# EAGLE design base_plate_noisy_crickets (EAGLE 9.6.2)
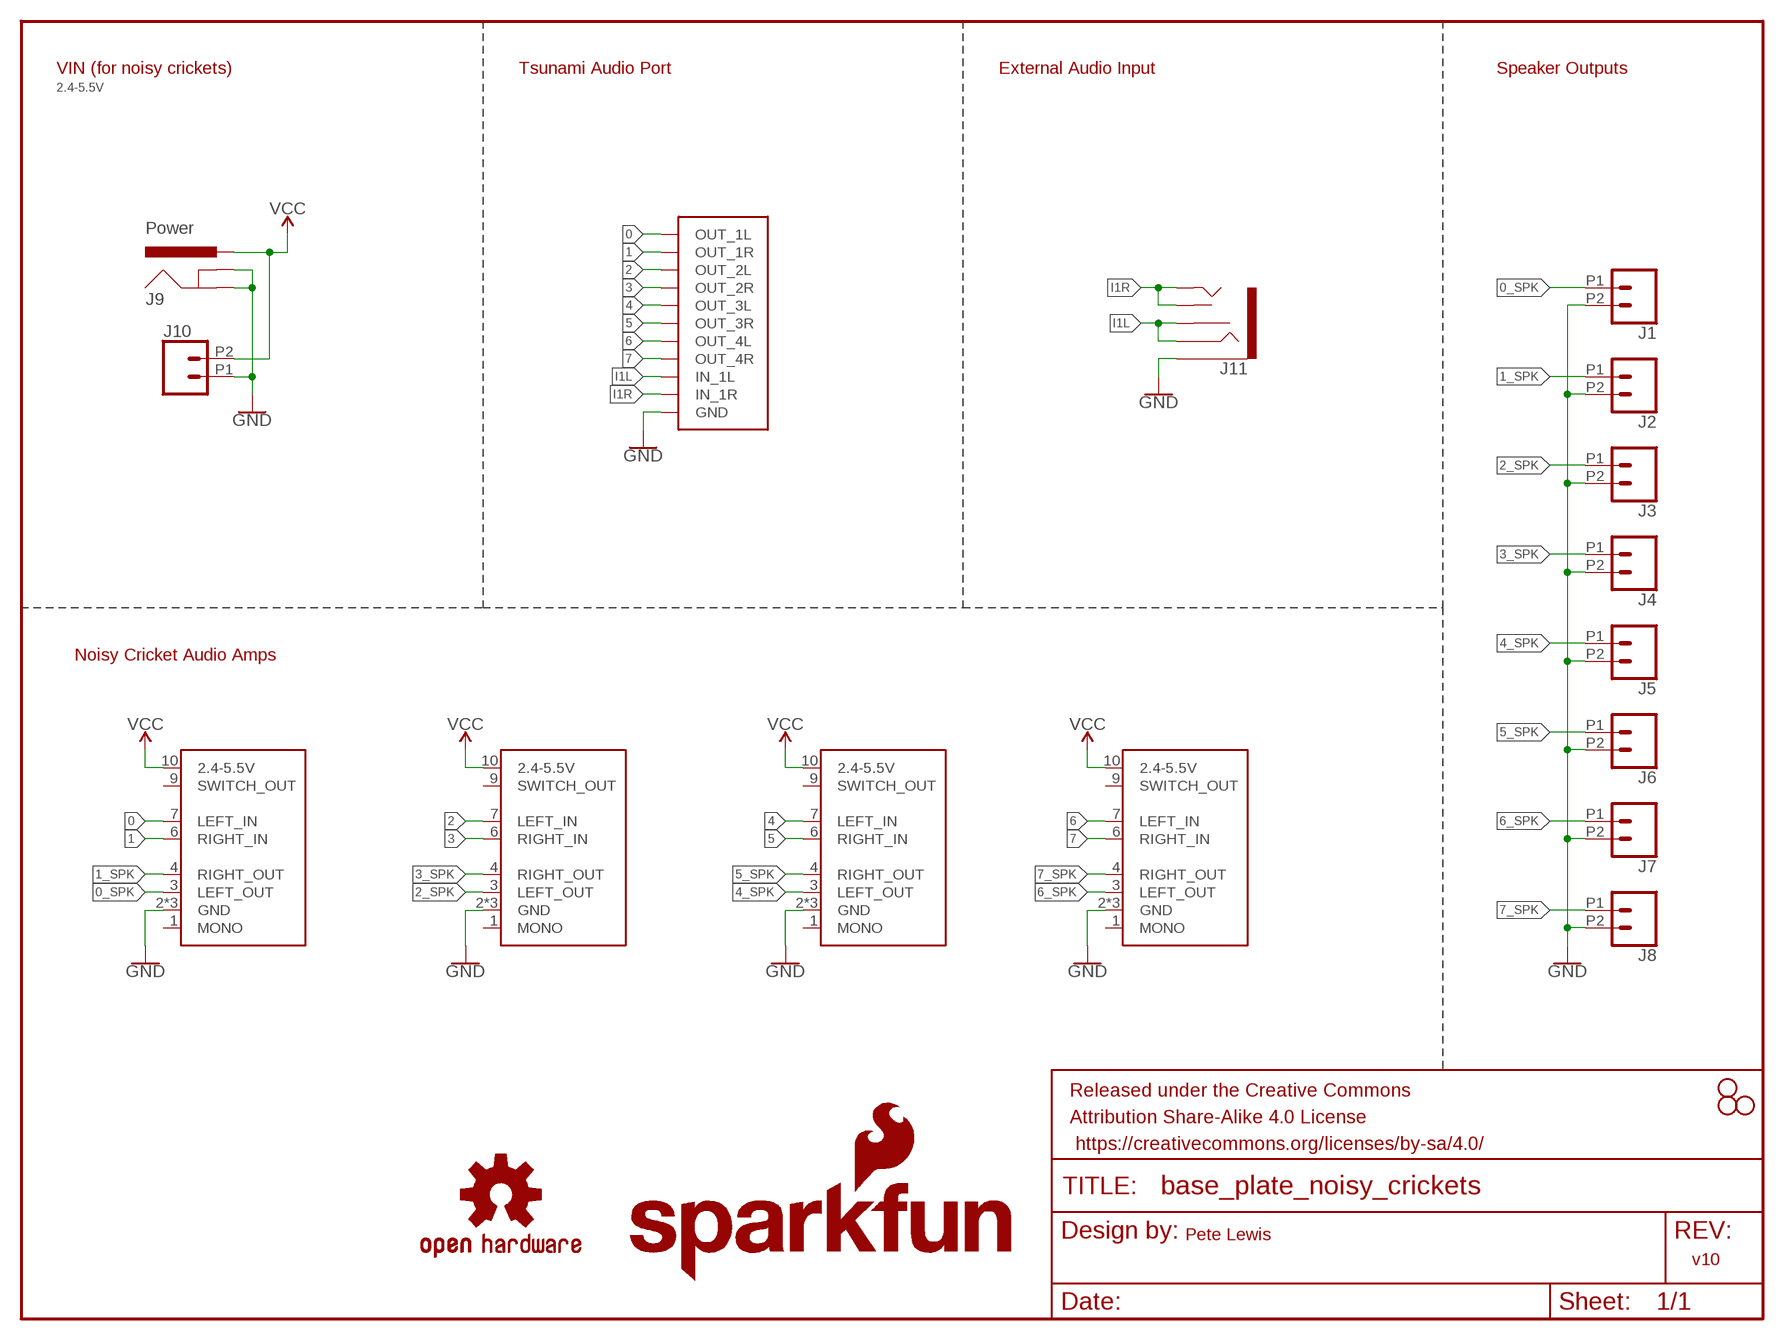
[diagram p0: schematic, sheet 1]

## Parts
FRAME1  FRAME-LETTER  [CREATIVE_COMMONS]
H1  STAND-OFFTIGHT  [STAND-OFF-TIGHT]
H3  STAND-OFFTIGHT  [STAND-OFF-TIGHT]
H4  STAND-OFFTIGHT  [STAND-OFF-TIGHT]
J1  CONN_022.54MM_SCREWTERM  [1X02_2.54_SCREWTERM]
J2  CONN_022.54MM_SCREWTERM  [1X02_2.54_SCREWTERM]
J3  CONN_022.54MM_SCREWTERM  [1X02_2.54_SCREWTERM]
J4  CONN_022.54MM_SCREWTERM  [1X02_2.54_SCREWTERM]
J5  CONN_022.54MM_SCREWTERM  [1X02_2.54_SCREWTERM]
J6  CONN_022.54MM_SCREWTERM  [1X02_2.54_SCREWTERM]
J7  CONN_022.54MM_SCREWTERM  [1X02_2.54_SCREWTERM]
J8  CONN_022.54MM_SCREWTERM  [1X02_2.54_SCREWTERM]
J9  Power  POWER_JACKPTH_LOCK  [POWER_JACK_PTH_LOCK]
J10  CONN_022.54MM_SCREWTERM  [1X02_2.54_SCREWTERM]
J11  AUDIO_JACK_3.5MM_PTH  [AUDIO-JACK]
LOGO1  SFE_LOGO_NAME_FLAME.1_INCH  [SFE_LOGO_NAME_FLAME_.1]
LOGO2  OSHW-LOGOS  [OSHW-LOGO-S]
LOGO3  SFE_LOGO_NAME_FLAME.3_INCH  [SFE_LOGO_NAME_FLAME_.3]
U$1  NOISY_CRICKET  [NOISY_CRICKET_W_PTH]
U$2  NOISY_CRICKET  [NOISY_CRICKET_W_PTH]
U$3  NOISY_CRICKET  [NOISY_CRICKET_W_PTH]
U$4  NOISY_CRICKET  [NOISY_CRICKET_W_PTH]
U$5  TSUNAMI_AUDIO_PORTS  [TSUNAMI_AUDIO_PORTS]

## Nets
0: U$1.7(LEFT_IN) U$5.O1L(OUT_1L)
0_SPK: J1.P1 U$1.3(LEFT_OUT)
1: U$1.6(RIGHT_IN) U$5.O1R(OUT_1R)
1_SPK: J2.P1 U$1.4(RIGHT_OUT)
2: U$2.7(LEFT_IN) U$5.O2L(OUT_2L)
2_SPK: J3.P1 U$2.3(LEFT_OUT)
3: U$2.6(RIGHT_IN) U$5.O2R(OUT_2R)
3_SPK: J4.P1 U$2.4(RIGHT_OUT)
4: U$3.7(LEFT_IN) U$5.O3L(OUT_3L)
4_SPK: J5.P1 U$3.3(LEFT_OUT)
5: U$3.6(RIGHT_IN) U$5.O3R(OUT_3R)
5_SPK: J6.P1 U$3.4(RIGHT_OUT)
6: U$4.7(LEFT_IN) U$5.O4L(OUT_4L)
6_SPK: J7.P1 U$4.3(LEFT_OUT)
7: U$4.6(RIGHT_IN) U$5.O4R(OUT_4R)
7_SPK: J8.P1 U$4.4(RIGHT_OUT)
GND: J1.P2 J2.P2 J3.P2 J4.P2 J5.P2 J6.P2 J7.P2 J8.P2 J9.GND J9.GNDBREAK J10.P1 J11.SLEEVE U$1.2(GND) U$1.5(GND) U$1.8(GND) U$2.2(GND) U$2.5(GND) U$2.8(GND) U$3.2(GND) U$3.5(GND) U$3.8(GND) U$4.2(GND) U$4.5(GND) U$4.8(GND) U$5.P$11(GND) U$5.P$12(GND) U$5.P$13(GND) U$5.P$14(GND) U$5.P$15(GND) U$5.P$16(GND) U$5.P$17(GND) U$5.P$18(GND) U$5.P$19(GND) U$5.P$20(GND)
I1L: J11.RING J11.RSH U$5.I1L(IN_1L)
I1R: J11.TIP J11.TSH U$5.I1R(IN_1R)
VCC: J9.PWR J10.P2 U$1.10(2.4-5.5V) U$2.10(2.4-5.5V) U$3.10(2.4-5.5V) U$4.10(2.4-5.5V)
Unconnected: U$1.1(MONO) U$1.9(SWITCH_OUT) U$2.1(MONO) U$2.9(SWITCH_OUT) U$3.1(MONO) U$3.9(SWITCH_OUT) U$4.1(MONO) U$4.9(SWITCH_OUT)

## Notes on the sheet
- VIN (for noisy crickets) | Tsunami Audio Port | External Audio Input | Speaker Outputs
- 2.4-5.5V
- Noisy Cricket Audio Amps
- Pete Lewis
- v10

## Library data of the parts
FRAME1 = SparkFun-Aesthetics:FRAME-LETTER: Schematic Frame - Letter Standard 8.5x11 US Letter frame
H1 H3 H4 = SparkFun-Hardware:STAND-OFF: Stand Off Drill holes for mechanically mounting via screws, standoffs, etc. Note: Use the keepout ring to avoid running the screw head into surrounding components. Variant Overviews STAND-OFF - Mechanical footprint for a #4 phillips button head screw. STAND-OFF-TIGHT - Mechanical footprint for a #4 phillips button head screw, Example SparkFun Products Screw - Phillips Head (1/4", 4-40, 10 pack) <https://www.sparkfun.com/products/10453> (PRT-10453) Screw - Phillips Head (1/2", 4-40, 10 pack) <https://www.sparkfun.com/products/10452> (PRT-10452) Screw - Phillips Head (3/4", 4-40, 10 pack) <https://www.sparkfun.com/products/10451> (PRT-10451) Screw - Phillips Head (1", 4-40, 10 pack) <https://www.sparkfun.com/products/10450> (PRT-10450)
J1-J8 J10 = SparkFun-Connectors:CONN_02: Multi connection point. Often used as Generic Header-pin footprint for 0.1 inch spaced/style header connections On any of the 0.1 inch spaced packages, you can populate with these: Break Away Headers - Straight <https://www.sparkfun.com/products/116> (PRT-00116) Break Away Male Headers - Right Angle <https://www.sparkfun.com/products/553> (PRT-00553) Female Headers <https://www.sparkfun.com/products/115> (PRT-00115) Break Away Headers - Machine Pin <https://www.sparkfun.com/products/117> (PRT-00117) Break Away Female Headers - Swiss Machine Pin <https://www.sparkfun.com/products/743> (PRT-00743) For SCREWTERMINALS and SPRING TERMINALS visit here: Screw Terimnals on SparkFun.com <https://www.sparkfun.com/search/results?term=Screw+Terminals> (5mm/3.5mm/2.54mm spacing) This device is also useful as a general connection point to wire up your design to another part of your project. Our various solder wires solder well into these plated through hole pads. Hook-Up Wire - Assortment (Stranded, 22 AWG) <https://www.sparkfun.com/products/11375> (PRT-11375) Hook-Up Wire - Assortment (Solid Core, 22 AWG) <https://www.sparkfun.com/products/11367> (PRT-11367) View the entire wire category on our website here <https://www.sparkfun.com/categories/141> Special notes: Molex polarized connector foot print use with: PRT-08233 with associated crimp pins and housings. 2.54_SCREWTERM for use with PRT-10571. 3.5mm Screw Terminal footprints for PRT-08084 5mm Screw Terminal footprints for use with PRT-08432
J9 = SparkFun-Connectors:POWER_JACK: Power Jack Connector This is the standard 5.5mm barrel jack for power. The PTH is the most common, proven, reliable, footprint. The Slot footprint only works if the mill layer is transmitted to the PCB fab house so be warned. Here are the connectors we sell at SparkFun: DC Barrel Power Jack/Connector <https://www.sparkfun.com/products/119> (PRT-00119) DC Barrel Power Jack/Connector (SMD) <https://www.sparkfun.com/products/12748> (PRT-12748) DC Barrel Jack Adapter - Breadboard Compatible <https://www.sparkfun.com/products/10811> (PRT-10811) It is used on this SparkFun product (and many, many others): SparkFun RedBoard - Programmed with Arduino <https://www.sparkfun.com/products/12757> (DEV-12757) Also, if you need a mating power supply or connector, please check these out: Wall Adapter Power Supply - 9VDC 650mA <https://www.sparkfun.com/products/298> (TOL-00298) DC Barrel Jack Adapter - Male <https://www.sparkfun.com/products/10287> (PRT-10287); PROD_ID: CONN-08197; SF_ID: PRT-00119
J11 = SparkFun-Connectors:AUDIO_JACK_3.5MM: Audio Jack 3.5mm variants of PTH and SMT stereo audio jack with bypass switches. SparkFun Products: SparkFun SparkPunk Sound Kit <[https://www.sparkfun.com/products/11177]> - PTH MP3 Trigger <https://www.sparkfun.com/products/13720> -3.5mm SMD SparkFun PicoBoard <https://www.sparkfun.com/products/11888>- 2.5mm SMD; PROD_ID: CONN-08774; SF_ID: PRT-08032
LOGO1 LOGO3 = SparkFun-Aesthetics:SFE_LOGO_NAME_FLAME: SparkFun Font Logo w/ Flame This is the SparkFun full logo. The logo on the schematic will always be the same size; the package variant is the height of the flame part of the logo. Default layer for the logo on the board is tSilk.
LOGO2 = SparkFun-Aesthetics:OSHW-LOGO: Open-Source Hardware (OSHW) Logo This logo indicates the piece of hardware it is found on incorporates a OSHW license and/or adheres to the definition of open source hardware found here: http://freedomdefined.org/OSHW
U$1-U$4 = audioflyer:NOISY_CRICKET
U$5 = audioflyer:TSUNAMI_AUDIO_PORTS

## Board
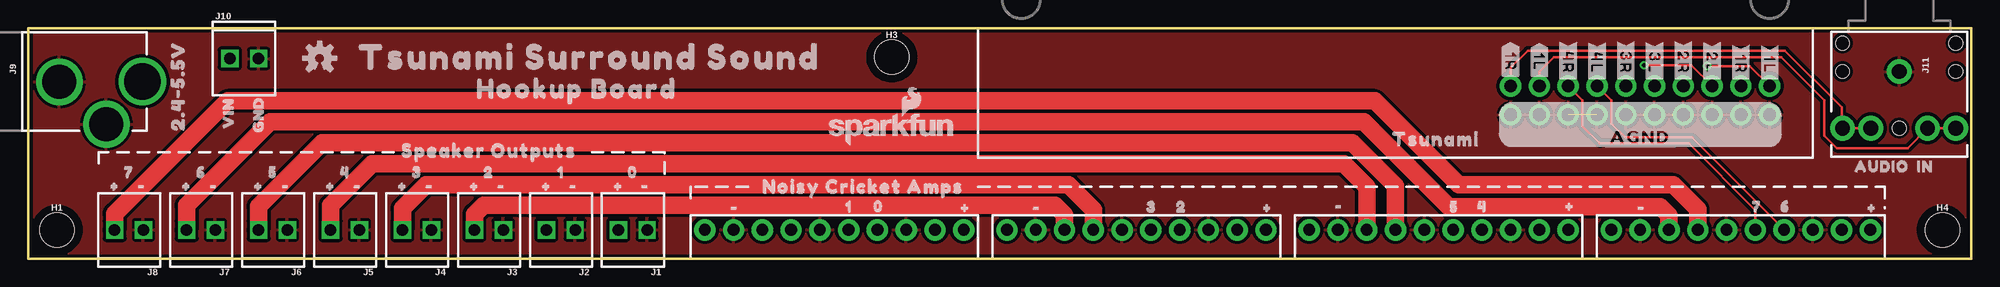
[diagram p1: board, top side]
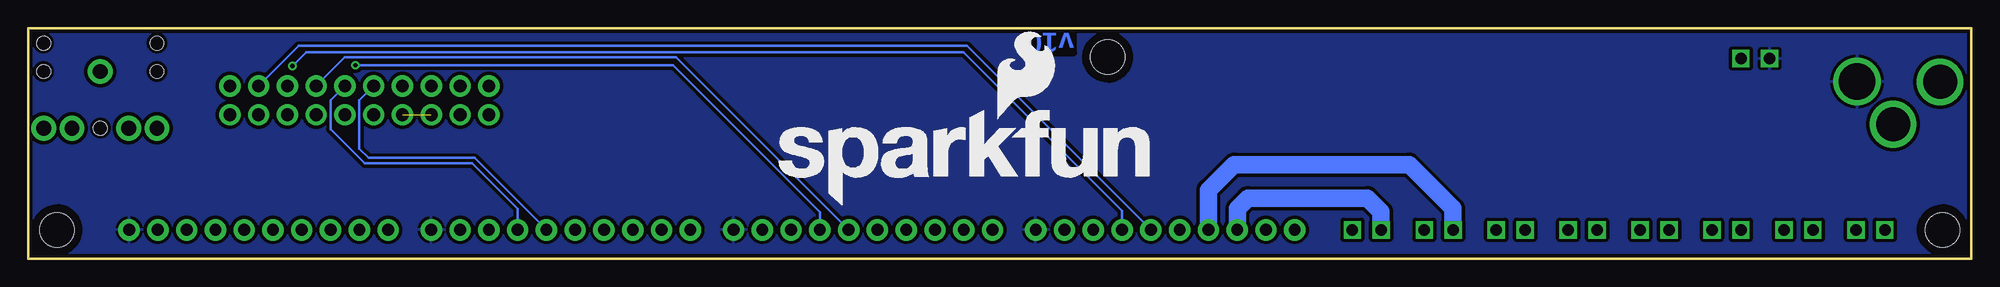
[diagram p2: board, bottom side, seen from below]

Size 171.45 x 20.32 mm. Coordinates in mm from the lower left corner, seen from the top.
Outline: 0,0 171.45,0 171.45,20.32 0,20.32 0,0
Copper layers (1*16): Top 0.035mm / dielectric 1.5mm / Bottom 0.035mm
Design rules "SparkFun-2-Layer-General-JLCPCB": minimum track width 7mil, minimum drill 0.3mm, track to track 7mil, track to pad 7mil, pad to pad 7mil, via to via 7mil, smd to smd 7mil, copper to edge 7mil, drill to drill 7mil, minimum pad ring 7mil, minimum via ring 7mil, stop-mask expansion 3mil, vias tented up to drill 25mil, thermal gap 10mil

### Footprints (pad centres in the part's own frame; a part is rotated, then mirrored left to right if it is on the bottom)
STAND-OFF-TIGHT = hole 3.048: 0,0
1X02_2.54_SCREWTERM = drill 1.016 square: P1 2.54,0; P2 0,0
POWER_JACK_PTH_LOCK = drill 2.997 pad 4.115: GND 0.025,6.557; GNDBREAK 3.762,10.7 | drill 3.2 pad 4.115: PWR 0,13.878
AUDIO-JACK = drill 1.3 pad 2.184: RING 5,5; RSH 5,2.5; SLEEVE 0,0; TIP 5,-5; TSH 5,-2.5 | hole 1.2: 0,5; -2.5,5; -2.5,-5; 0,-5; 5,0
NOISY_CRICKET_W_PTH = drill 1.041 pad 1.88: 1 -26.67,-2.54; 2 -26.67,0; 3 -26.67,2.54; 4 -26.67,5.08; 5 -26.67,7.62; 6 -26.67,10.16; 7 -26.67,12.7; 8 -26.67,15.24; 9 -26.67,17.78; 10 -26.67,20.32
TSUNAMI_AUDIO_PORTS = drill 1.118 pad 1.88: I1L 0,2.54; I1R 0,0; O1L 0,22.86; O1R 0,20.32; O2L 0,17.78; O2R 0,15.24; O3L 0,12.7; O3R 0,10.16; O4L 0,7.62; O4R 0,5.08; P$11 2.54,0; P$12 2.54,2.54; P$13 2.54,5.08; P$14 2.54,7.62; P$15 2.54,10.16; P$16 2.54,12.7; P$17 2.54,15.24; P$18 2.54,17.78; P$19 2.54,20.32; P$20 2.54,22.86

### Placement (x,y rotation side)
E$6  [REDBOARD_ARTEMIS]  0,25.4 0 top  (outside the outline)
E$8  [THING_PLUS]  2.54,64.77 270 top  (outside the outline)
FRAME1  15.24,-57.15 0 top  (outside the outline)
H1  2.54,2.54 0 top
H3  76.2,17.78 0 top
H4  168.91,2.54 0 top
J1  54.61,2.54 180 top
J2  48.26,2.54 180 top
J3  41.91,2.54 180 top
J4  35.56,2.54 180 top
J5  29.21,2.54 180 top
J6  22.86,2.54 180 top
J7  16.51,2.54 180 top
J8  10.16,2.54 180 top
J9  -3.81,15.62 270 top
J10  17.78,17.65 0 top
J11  165.1,16.51 270 top
LOGO1  76.2,11.43 0 top
LOGO2  25.7,17.68 0 top
LOGO3  88.9,8.89 0 bottom
U$1  62.23,-24.13 270 top
U$2  88.9,-24.13 270 top
U$3  115.57,-24.13 270 top
U$4  142.24,-24.13 270 top
U$5  130.81,15.24 270 top
U$6  [AUDIO0]  163.58,8.13 0 top
U$7  [IN0]  167.39,8.13 0 top
U$8  [00]  53.34,7.62 0 top
U$9  [10]  46.99,7.62 0 top
U$10  [20]  40.64,7.62 0 top
U$11  [30]  34.29,7.62 0 top
U$12  [40]  27.94,7.62 0 top
U$13  [50]  21.59,7.62 0 top
U$14  [60]  15.24,7.62 0 top
U$15  [70]  8.89,7.62 0 top
U$16  [#0]  52.07,6.35 0 top
U$17  [#0]  45.72,6.35 0 top
U$18  [#0]  39.37,6.35 0 top
U$19  [#0]  33.02,6.35 0 top
U$20  [#0]  26.67,6.35 0 top
U$21  [#0]  20.32,6.35 0 top
U$22  [#0]  13.97,6.35 0 top
U$23  [#0]  7.62,6.35 0 top
U$24  [#_0]  16.51,6.35 0 top
U$25  [#_0]  10.16,6.35 0 top
U$26  [#_0]  22.86,6.35 0 top
U$27  [#_0]  29.21,6.35 0 top
U$28  [#_0]  35.56,6.35 0 top
U$29  [#_0]  41.91,6.35 0 top
U$30  [#_0]  48.26,6.35 0 top
U$31  [VIN0]  17.65,12.83 90 top
U$32  [#_0]  54.61,6.35 0 top
U$33  [GND0]  20.32,12.7 90 top
U$34  [TSUNAMI_SURROUND_SOUND0]  49.53,17.78 0 top
U$35  [HOOKUP_BOARD0]  48.39,14.99 0 top
U$36  [2#4#5#5V0]  13.21,15.24 90 top
U$37  [#AGND#0]  142.24,10.72 0 top
U$38  [#1R#0]  151.13,15.49 270 top
U$39  [#2L#0]  148.59,15.49 270 top
U$40  [#2R#0]  146.05,15.49 270 top
U$41  [#3R#0]  140.97,15.49 270 top
U$42  [#3L#0]  143.51,15.49 270 top
U$43  [#4L#0]  138.43,15.49 270 top
U$44  [#4R#0]  135.89,15.49 270 top
U$45  [#1L#0]  153.67,15.49 270 top
U$46  [NOISY_CRICKET_AMPS0]  73.66,6.35 0 top
U$47  [TSUNAMI0]  124.21,10.54 0 top
U$48  [#_0]  62.48,4.45 0 top
U$49  [#0]  82.68,4.45 0 top
U$50  [#0]  109.35,4.45 0 top
U$51  [#0]  136.02,4.57 0 top
U$52  [#0]  162.69,4.45 0 top
U$53  [#_0]  89.15,4.45 0 top
U$54  [#_0]  115.82,4.57 0 top
U$55  [#_0]  142.49,4.45 0 top
U$56  [SPEAKER_OUTPUTS0]  40.64,9.52 0 top
U$57  [00]  75.03,4.6 0 top
U$58  [10]  72.42,4.57 0 top
U$59  [20]  101.75,4.57 0 top
U$60  [30]  99.11,4.55 0 top
U$61  [40]  128.3,4.6 0 top
U$62  [50]  125.83,4.57 0 top
U$63  [60]  155.04,4.6 0 top
U$64  [70]  152.55,4.6 0 top
U$65  [TSUNAMI]  83.82,83.82 270 top  (outside the outline)
U$116  [#1L#3]  133.35,15.72 270 top
U$164  [#1R#3]  130.81,15.72 270 top

### Tracks (layer width: path | path; a pad name or v marks a point on that pad's centre or on a via)
0  (via drill 0.38)
  Top 0.203: U$5.O1L 151.92,16.99 v148.16,16.99
  Bottom 0.203: v148.16,16.99 146.94,18.21 88.93,18.21 74.93,4.22 U$1.7
0_SPK
  Bottom 1.524: U$1.3 64.77,4.39 63.83,5.33 53.26,5.33 52.07,4.14 J1.P1
1
  Bottom 0.203: U$5.O1R 147.6,18.77 88.62,18.77 U$1.6
1_SPK
  Bottom 1.524: U$1.4 67.31,6.05 65.05,8.31 49.58,8.31 45.72,4.45 J2.P1
2  (via drill 0.38)
  Top 0.203: U$5.O2L 146.76,17.07 v142.6,17.07
  Bottom 0.203: v142.6,17.07 114.55,17.07 101.6,4.12 U$2.7
2_SPK
  Top 1.524: J3.P1 39.37,3.94 40.16,4.72 90.6,4.72 91.44,3.89 U$2.3
3
  Bottom 0.203: U$5.O2R 143.53,17.75 114.28,17.75 U$2.6
3_SPK
  Top 1.524: J4.P1 33.02,4.45 35.1,6.53 91.77,6.53 93.98,4.32 U$2.4
4
  Bottom 0.203: U$5.O3L 144.78,13.97 144.78,11.43 141.76,8.41 132.28,8.41 128.27,4.39 U$3.7
4_SPK
  Top 1.524: J5.P1 26.67,4.7 30.33,8.36 116.08,8.36 118.11,6.32 U$3.3
5
  Bottom 0.203: U$5.O3R 142.24,13.97 142.24,9.7 141.43,8.89 132.08,8.89 U$3.6
5_SPK
  Top 1.524: J6.P1 20.32,4.62 25.93,10.24 116.87,10.24 120.65,6.45 U$3.4
6
  Top 0.203: U$5.O4L 139.7,13.97 139.7,11.91 140.92,10.69 146.79,10.69 U$4.7
6_SPK
  Top 1.524: J7.P1 13.97,4.7 21.36,12.09 117.86,12.09 125.35,4.6 144.02,4.6 144.78,3.84 U$4.3
7
  Top 0.203: U$4.6 152.4,4.29 146.53,10.16 138.68,10.16 137.16,11.68 137.16,13.97 U$5.O4R
7_SPK
  Top 1.524: J8.P1 7.62,3.96 17.58,13.92 118.82,13.92 126.24,6.5 145.19,6.5 147.32,4.37 U$4.4
GND  (1 unrouted)
  pour Top (isolate 0.305): 0,0 0,20.32 171.45,20.32 171.45,0
I1L
  Top 0.203: U$5.I1L 133.35,16.51 134.62,17.78 154.71,17.78 158.5,13.99 158.5,10.85 159.59,9.75 165.84,9.75 J11.RSH J11.RING
I1R
  Top 0.203: J11.TSH J11.TIP 160.02,11.59 160.02,13.36 155.02,18.36 132.31,18.36 130.81,16.87 U$5.I1R
VCC
  pour Bottom (isolate 0.305): 0,0 0,20.32 171.45,20.32 171.45,0

### Text on the board
Bottom: v10
tDocu: Pete Lewis